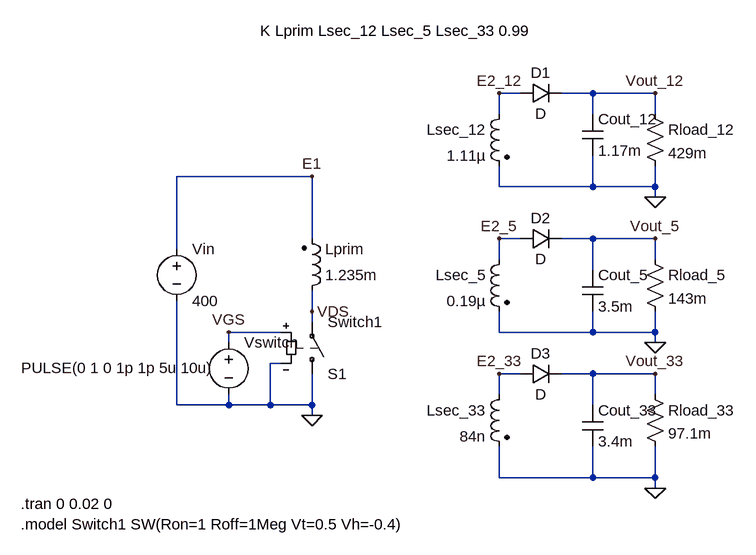
[diagram p0: schematic BasicFlyBack.asc]
BasicFlyBack.asc, the LTspice schematic file:
Version 4
SHEET 1 880 712
WIRE 48 32 16 32
WIRE 160 32 112 32
WIRE 256 32 160 32
WIRE 16 64 16 32
WIRE 160 64 160 32
WIRE 256 64 256 32
WIRE -272 160 -480 160
WIRE 16 176 16 144
WIRE 160 176 160 128
WIRE 160 176 16 176
WIRE 256 176 256 144
WIRE 256 176 160 176
WIRE 256 192 256 176
WIRE -272 256 -272 160
WIRE 48 256 16 256
WIRE 160 256 112 256
WIRE 256 256 160 256
WIRE -480 272 -480 160
WIRE 16 288 16 256
WIRE 256 288 256 256
WIRE 160 304 160 256
WIRE -272 368 -272 336
WIRE -272 384 -272 368
WIRE -320 400 -400 400
WIRE 16 400 16 368
WIRE 160 400 160 368
WIRE 160 400 16 400
WIRE 256 400 256 368
WIRE 256 400 160 400
WIRE -400 416 -400 400
WIRE 256 416 256 400
WIRE -320 448 -336 448
WIRE 48 464 16 464
WIRE 160 464 112 464
WIRE 256 464 160 464
WIRE 16 496 16 464
WIRE 256 496 256 464
WIRE -480 512 -480 352
WIRE -400 512 -400 496
WIRE -400 512 -480 512
WIRE -336 512 -336 448
WIRE -336 512 -400 512
WIRE -272 512 -272 464
WIRE -272 512 -336 512
WIRE 160 512 160 464
WIRE -272 528 -272 512
WIRE 16 624 16 576
WIRE 160 624 160 576
WIRE 160 624 16 624
WIRE 256 624 256 576
WIRE 256 624 160 624
WIRE 256 640 256 624
FLAG -272 528 0
FLAG 256 640 0
FLAG 256 416 0
FLAG 256 192 0
FLAG -272 160 E1
FLAG 16 32 E2_12
FLAG 16 256 E2_5
FLAG 16 464 E2_33
FLAG 256 32 Vout_12
FLAG 256 256 Vout_5
FLAG 256 464 Vout_33
FLAG -400 400 VGS
FLAG -272 368 VDS
SYMBOL voltage -480 256 R0
SYMATTR InstName Vin
SYMATTR Value 400
SYMBOL ind2 -288 352 M180
WINDOW 0 36 80 Left 2
WINDOW 3 36 40 Left 2
SYMATTR InstName Lprim
SYMATTR Value 1.235m
SYMATTR Type ind
SYMATTR SpiceLine Rser=1m
SYMBOL ind2 32 48 M0
SYMATTR InstName Lsec_12
SYMATTR Value 1.11µ
SYMATTR Type ind
SYMATTR SpiceLine Rser=1m
SYMBOL ind2 32 272 M0
SYMATTR InstName Lsec_5
SYMATTR Value 0.19µ
SYMATTR Type ind
SYMATTR SpiceLine Rser=1m
SYMBOL ind2 32 480 M0
SYMATTR InstName Lsec_33
SYMATTR Value 84n
SYMATTR Type ind
SYMATTR SpiceLine Rser=1m
SYMBOL sw -272 480 M180
SYMATTR InstName S1
SYMATTR Value Switch1
SYMBOL voltage -400 400 R0
WINDOW 3 -319 55 Left 2
WINDOW 123 0 0 Left 0
WINDOW 39 0 0 Left 0
SYMATTR Value PULSE(0 1 0 1p 1p 5u 10u)
SYMATTR InstName Vswitch
SYMBOL res 240 48 R0
SYMATTR InstName Rload_12
SYMATTR Value 429m
SYMBOL res 240 272 R0
SYMATTR InstName Rload_5
SYMATTR Value 143m
SYMBOL res 240 480 R0
SYMATTR InstName Rload_33
SYMATTR Value 97.1m
SYMBOL cap 144 512 R0
SYMATTR InstName Cout_33
SYMATTR Value 3.4m
SYMBOL cap 144 304 R0
SYMATTR InstName Cout_5
SYMATTR Value 3.5m
SYMBOL cap 144 64 R0
SYMATTR InstName Cout_12
SYMATTR Value 1.17m
SYMBOL diode 48 48 R270
WINDOW 0 32 32 VTop 2
WINDOW 3 0 32 VBottom 2
SYMATTR InstName D1
SYMBOL diode 48 272 R270
WINDOW 0 32 32 VTop 2
WINDOW 3 0 32 VBottom 2
SYMATTR InstName D2
SYMBOL diode 48 480 R270
WINDOW 0 32 32 VTop 2
WINDOW 3 0 32 VBottom 2
SYMATTR InstName D3
TEXT -352 -64 Left 2 !K Lprim Lsec_12 Lsec_5 Lsec_33 0.99
TEXT -720 664 Left 2 !.tran 0 0.02 0
TEXT -720 696 Left 2 !.model Switch1 SW(Ron=1 Roff=1Meg Vt=0.5 Vh=-0.4)

The netlist it stands for:
* BasicFlyBack.asc
Vin E1 0 400
Lprim VDS E1 1.235m Rser=1m
Lsec_12 E2_12 0 1.11µ Rser=1m
Lsec_5 E2_5 0 0.19µ Rser=1m
Lsec_33 E2_33 0 84n Rser=1m
S1 0 VDS VGS 0 Switch1
Vswitch VGS 0 PULSE(0 1 0 1p 1p 5u 10u)
Rload_12 Vout_12 0 429m
Rload_5 Vout_5 0 143m
Rload_33 Vout_33 0 97.1m
Cout_33 Vout_33 0 3.4m
Cout_5 Vout_5 0 3.5m
Cout_12 Vout_12 0 1.17m
D1 E2_12 Vout_12 D
D2 E2_5 Vout_5 D
D3 E2_33 Vout_33 D
.model D D
.lib standard.dio
K Lprim Lsec_12 Lsec_5 Lsec_33 0.99
.tran 0 0.02 0
.model Switch1 SW(Ron=1 Roff=1Meg Vt=0.5 Vh=-0.4)
.backanno
.end